# Altium project Driver_Modulation.PrjPcb (part 2 of 2)

## Sheet PD_Receiver_Circuit.SchDoc: Receiver amplifier
size A3; Author: Agni, Peter; SheetNumber: 4; SheetTotal: 9; SPICEModelCacheSWUYWAZA: <root> / <DocumentId>SWUYWAZA</DocumentId> / </root>
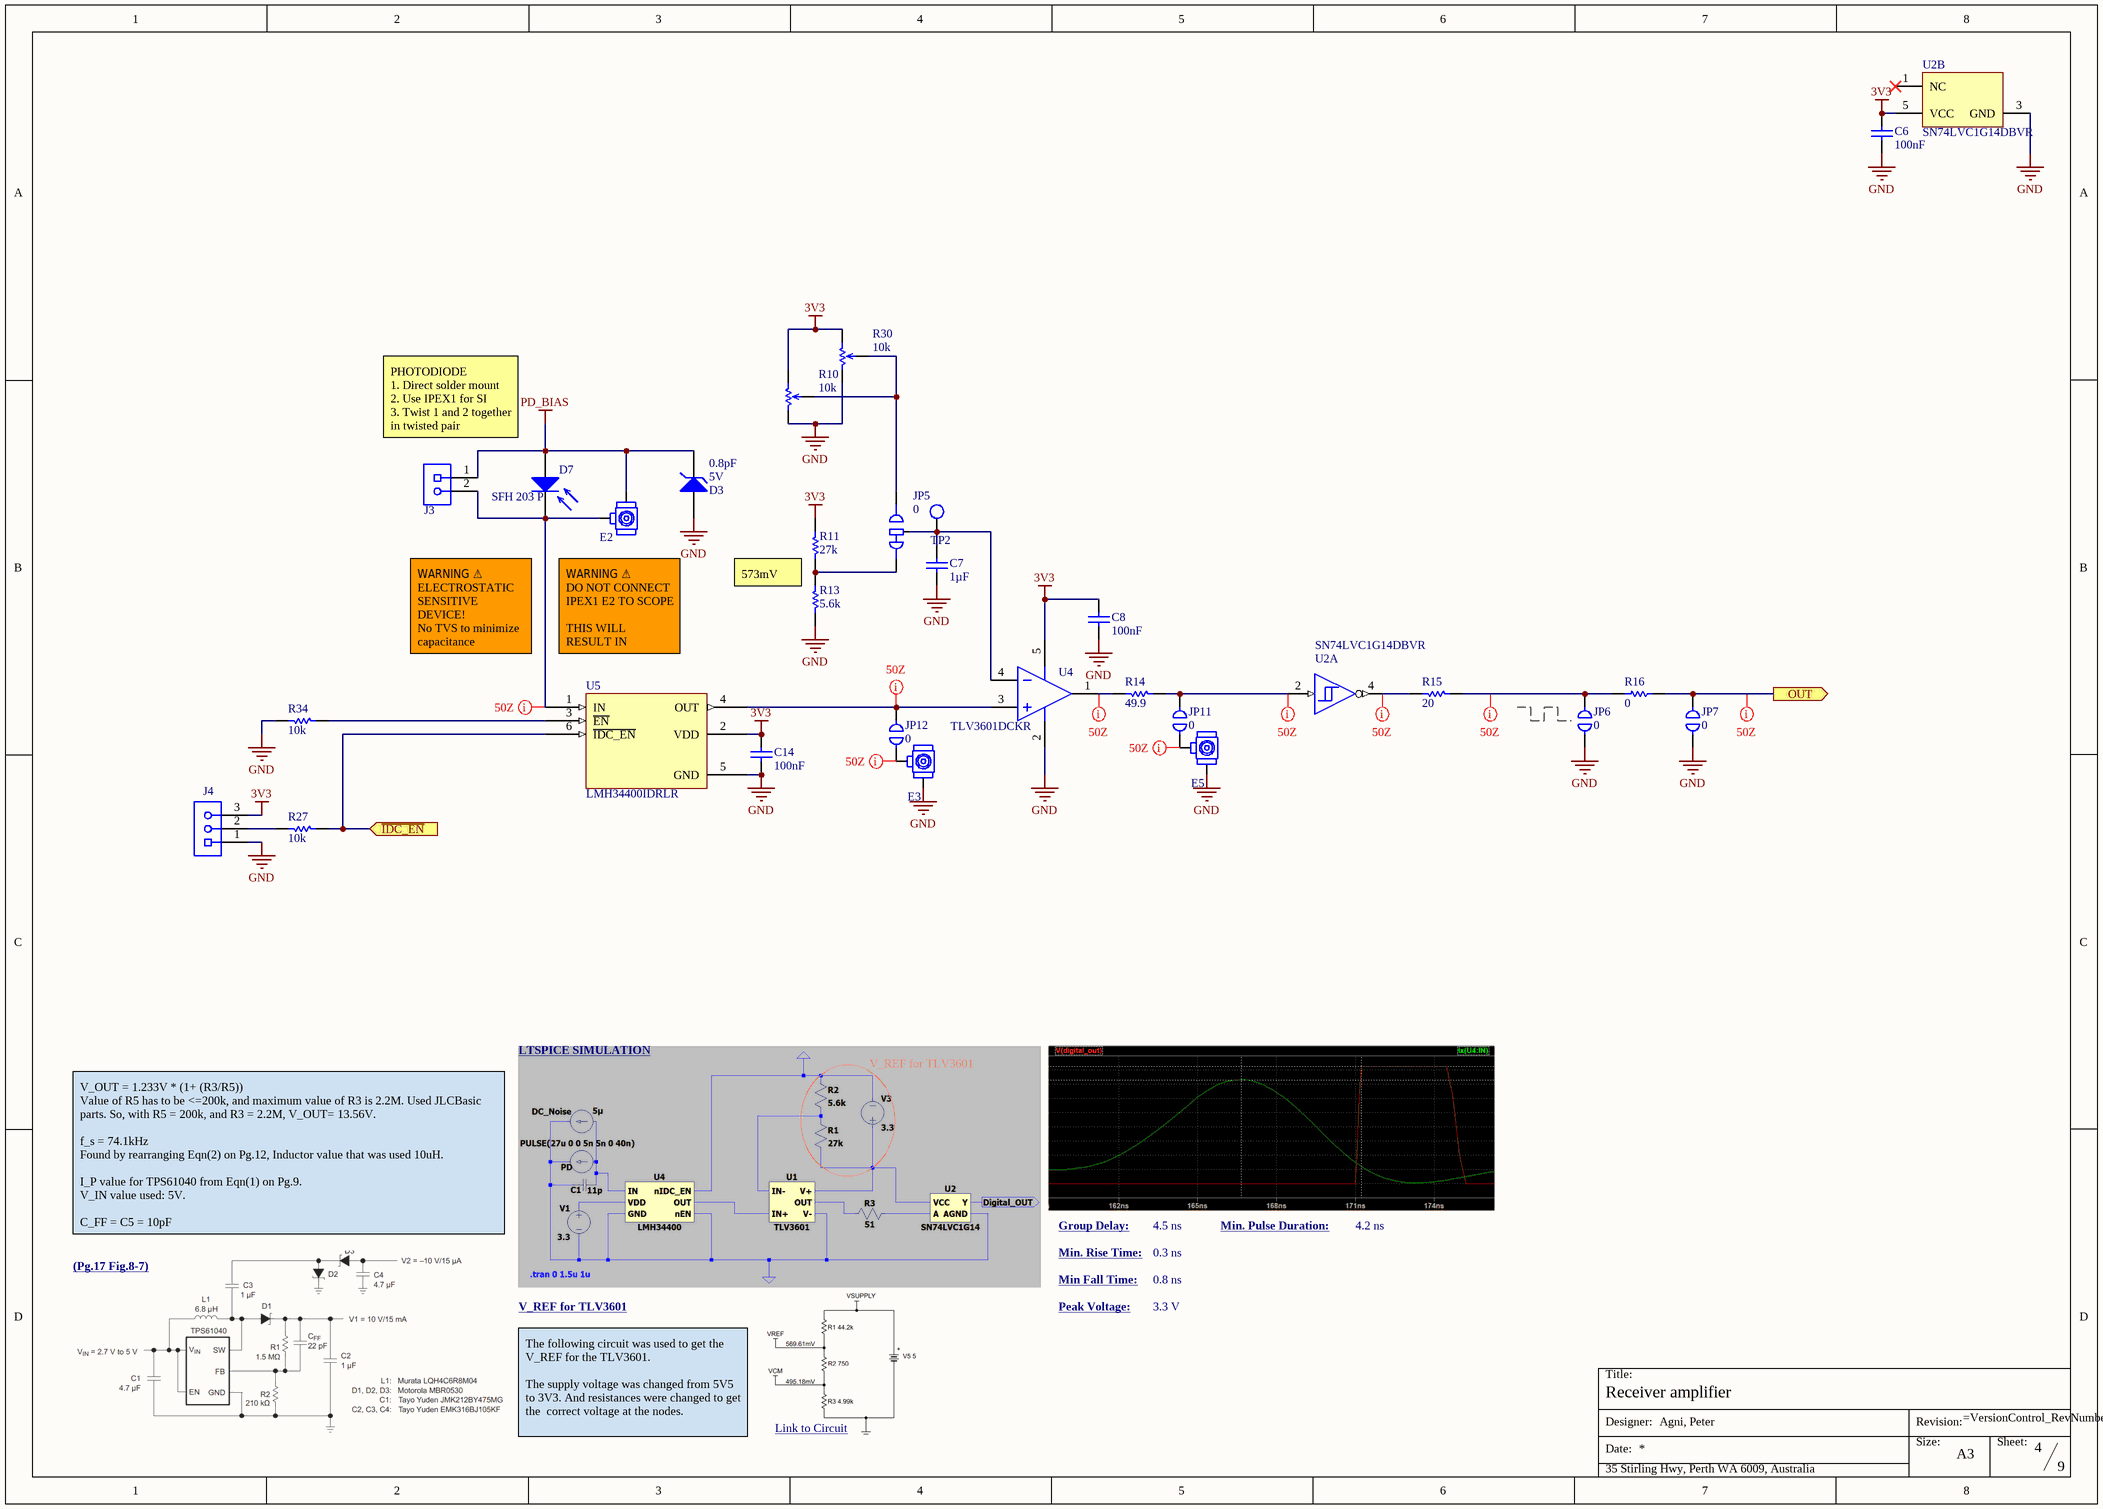
[diagram p5: PD_Receiver_Circuit.SchDoc]

### Parts
C6  value 100nF  [CAPC1005X06N]  (hidden comment: CL05B104KB54PNC)
C7  value 1µF  [CAPC1005X06N]  (hidden comment: CL05A105KA5NQNC)
C8  value 100nF  [CAPC1005X06N]  (hidden comment: CL05B104KB54PNC)
C14  value 100nF  [CAPC1005X06N]  (hidden comment: CL05B104KB54PNC)
D3  value 5V  Capacitance: 0.8pF  [DFN60P100X45-2L]  (hidden comment: H5VU10U)
D7  SFH 203 P  [SFH203P]
E2  U.FL-R-SMT-1(01)  [HRS-U.FL-R-SMT-3_V 4_LAYER_KO]  (value not drawn)
E3  U.FL-R-SMT-1(01)  [HRS-U.FL-R-SMT-3_V 4_LAYER_KO]  (value not drawn)
E5  U.FL-R-SMT-1(01)  [HRS-U.FL-R-SMT-3_V 4_LAYER_KO]  (value not drawn)
J3  B2B-PH-K-S(LF)(SN)  [JST_B2B-PH-K-S(LF)(SN)]  (value not drawn)
J4  10129378-903001BLF  [10129378-903001BLF-Footprint-1]  (value not drawn)
JP5  value 0  [RESC1005X04N TWO STATE]  (hidden comment: JUMPER-0402 TWO STATE)
JP6  value 0  [RESC1005X04N]  (hidden comment: JUMPER-0402)  (no BOM)
JP7  value 0  [RESC1005X04N]  (hidden comment: JUMPER-0402)  (no BOM)
JP11  value 0  [RESC1005X04N]  (hidden comment: JUMPER-0402)  (no BOM)
JP12  value 0  [RESC1005X04N]  (hidden comment: JUMPER-0402)  (no BOM)
R10  value 10k  [BOUR-TC33X-2_V]  (hidden comment: TC33X-2-103E)
R11  value 27k  [RESC1005X04N]  (hidden comment: 0402WGF2702TCE)
R13  value 5.6k  [RESC1005X04N]  (hidden comment: 0402WGF5601TCE)
R14  value 49.9  [RESC1005X04N]  (hidden comment: 0402WGF499JTCE)
R15  value 20  [RESC1608X05N]  (hidden comment: 0603WAF200JT5E)
R16  value 0  [RESC1005X04N]  (hidden comment: 0402WGF0000TCE)
R27  value 10k  [RESC1005X04N]  (hidden comment: CRCW0402-10K0FKED)
R30  value 10k  [POT_RK0971-L-15KC_N-1]  (hidden comment: RK0971114D0B)
R34  value 10k  [RESC1005X04N]  (hidden comment: CRCW0402-10K0FKED)
TP2  Test Point 5001  [FP-5001-MFG]  (value not drawn)
U2  SN74LVC1G14DBVR  [DBV0005A_N]  (parts A,B of 2)
U4  TLV3601DCKR  [DCK0005A_SC-70-5_TI_SOT65P210X110-5N]
U5  LMH34400IDRLR  [SOTFL50P160X60-6N]

### Ports
OUT (out), ~{IDC_EN} (in)

### Nets
3V3: C6.2 C8.2 C14.2 J4.3 R10.3(CW) R11.2 R30.3(CW) U2.5(VCC) U4.5(V+) U5.2(VDD)
GND: C6.1 C7.1 C8.1 C14.1 D3.2(A) E3.2(GND) E5.2(GND) J4.1 JP6.1 JP7.1 R10.1(CCW) R13.1 R30.1(CCW) R34.2 U2.3(GND) U4.2(V-) U5.5(GND)
PD_BIAS: D3.1(K) D7.2(A) E2.2(GND) J3.1
AMBIENT_CANCEL: R27.1 U5.6(~{IDC_EN}) ; port ~{IDC_EN}
OUTPUT: JP7.2 R16.1 ; port OUT
NetC7_2: C7.2 JP5.3(COM) TP2.1 U4.4(IN-)
NetD7_1: D7.1(K) E2.1(SIG) J3.2 U5.1(IN)
NetE3_1: E3.1(SIG) JP12.1
NetE5_1: E5.1(SIG) JP11.1
NetJ4_2: J4.2 R27.2
NetJP5_1: JP5.1 R10.2(W) R30.2(W)
NetJP5_2: JP5.2 R11.1 R13.2
NetJP6_2: JP6.2 R15.2 R16.2
NetJP11_2: JP11.2 R14.2 U2.2(A)
NetJP12_2: JP12.2 U4.3(IN+) U5.4(OUT)
NetR14_1: R14.1 U4.1(OUT)
NetR15_1: R15.1 U2.4(Y)
NetR34_1: R34.1 U5.3(~{EN})

Not connected (* = marked no-connect by the designer): U2 1(NC)*

### Layout directives
net class 50Z: NetD7_1, NetE3_1, NetE5_1, NetJP6_2, NetJP11_2, NetJP12_2, NetR14_1, NetR15_1, OUTPUT

### Notes on the sheet
- PHOTODIODE
  1. Direct solder mount
  2. Use IPEX1 for SI
  3. Twist 1 and 2 together in twisted pair
- 573mV
- WARNING ⚠
  ELECTROSTATIC SENSITIVE DEVICE!
  No TVS to minimize capacitance
  Avoid contact
- WARNING ⚠
  DO NOT CONNECT IPEX1 E2 TO SCOPE
  THIS WILL RESULT IN SHORT-CIRCUIT
- LTSPICE SIMULATION
- V_REF for TLV3601
- V_OUT = 1.233V * (1+ (R3/R5))
  Value of R5 has to be <=200k, and maximum value of R3 is 2.2M. Used JLCBasic parts. So, with R5 = 200k, and R3 = 2.2M, V_OUT= 13.56V.
  f_s = 74.1kHz
  Found by rearranging Eqn(2) on Pg.12, Inductor value that was used 10uH.
  I_P value for TPS61040 from Eqn(1) on Pg.9.
  V_IN value used: 5V.
  C_FF = C5 = 10pF
  C5 = 1/(2*pi*(f_s/20)*R1)
- Group Delay:
- Min. Rise Time:
- 4.5 ns
- 0.3 ns
- Min. Pulse Duration:
- 4.2 ns
- (Pg.17 Fig.8-7) <https://www.ti.com/lit/ds/symlink/tps61041.pdf>
- Min Fall Time:
- Peak Voltage:
- 0.8 ns
- 3.3 V
- The following circuit was used to get the V_REF for the TLV3601.
  The supply voltage was changed from 5V5 to 3V3. And resistances were changed to get the  correct voltage at the nodes.
- Link to Circuit <https://www.ti.com/lit/ab/snoaa83/snoaa83.pdf?ts=1756539067414&ref_url=https%253A%252F%252Fwww.ti.com%252F>
- Title:
- Designer:
- Date:
- Size:
- Revision:
- A3
- Sheet:
- 35 Stirling Hwy, Perth WA 6009, Australia

### Library data of the parts
C6 C8 C14 = CMP-00074-10: Ceramic Capacitor, Multilayer, Ceramic, 50V, 10% +Tol, 10% -Tol, X7R, 15% TC, 0.1uF, Surface Mount, 0402; Dielectric: X7R; RoHS Compliant: Yes; Case Code (Imperial): 0402; Tolerance: 10%; JLC_PN: C307331; Voltage Rating: 50V; Source: JLCPCB(Basic)
C7 = CMP-00190-9: Ceramic Capacitor, Multilayer, Ceramic, 25V, 10% +Tol, 10% -Tol, X5R, 15% TC, 1uF, Surface Mount, 0402; JLC_PN: C52923; RoHS Compliant: Yes; Source: JLCPCB(Basic); Voltage Rating: 25V; Case Code (Imperial): 0402; Dielectric: X5R; Tolerance: 10%
D3 = CMP-00841-4: 5A 55W 16V 9V Unidirectional 5V DFN1006-2L  ESD and Surge Protection (TVS/ESD) ROHS; Breakdown Voltage: 9V; Source: JLCPCB(Basic); JLC_PN: C22395519; Polarity: Unidirectional; RoHS Compliant: Unsure; Package: DFN1006-2L; Peak Pulse Power Dissipation: 55W; Clamping Voltage: 16V
D7 = CMP-111-000002-3: Photodiode PIN Chip 850nm 0.62A/W Sensitivity 2-Pin T-1 3/4; Forward Voltage: 1.3V; Shape: Square; Max Power Dissipation: 150mW; Reverse Voltage: 20V; Fall Time: 5ns; Max Reverse Voltage (DC): 50V; Viewing Angle: 150°; Forward Current: 80mA; Number of Circuits: 1; Dark Current: 5nA; Max Reverse Current: 0A; Max Repetitive Reverse Voltage (Vrrm): 0V; Technology: 0; Peak Wavelength: 850nm; RoHS Compliant: Unsure; Case/Package: Radial; Contact Plating: Tin; Wavelength: 850nm; Rise Time: 5ns; Pins: 2; Height: 4.6mm; Power Dissipation: 150mW; Length: 5.7mm; Source: Distributor; Reverse Voltage (DC): 50V; Width: 5.7mm; Reverse Breakdown Voltage: 50V; Mounting Technology: Through Hole; Max Forward Surge Current (Ifsm): 0A; Diode Type: PIN; Max Operating Temperature: 100°C; Response Time: 5ns; RoHS: Compliant; Min Operating Temperature: -40°C
E2 E3 E5 = CMP-00380-18: Rf Connectors / Coaxial Connectors SMT Ml Rec Au 50 Ohm W/anti Sldr Wicking UFL; Number of Ports: 1; Dielectric Material: Polymer; Impedance: 50; Mating Cycles: 30; Connector Type: Receptacle,Male Pin; Body Plating: Silver; Center Contact Plating: Gold; Max Frequency: 6GHz; Body Material: Bronze; Lead Free: Lead Free; Series: U.FL; JLC PN: C88374; Contact Material: Brass; Fastening Type: SNAP-ON; Min Operating Temperature: -40°C; RoHS Compliant: Yes; Housing Color: Beige; Depth: 3mm; Contact Plating: Gold; Mount: Surface Mount; Length: 3.1mm; Orientation: Vertical; Termination: Solder; Max Operating Temperature: 90°C; Source: UWAA_Stock
J3 = CMP-00690-1: Board Connector, 2 Contact(s), 1 Row(s), Male, Straight, 0.079 inch Pitch, Solder Terminal, Locking, Natural Insulator
J4 = CMP-00188-3: Conn Unshrouded Header HDR 3 POS 2.54mm Solder ST Thru-Hole Poly Bag; RoHS Compliant: Unsure; Source: Aliexpress
JP5 = CMP-009-00003-3: JUMPER-0402 TWO STATE Fixed Resistor, Metal Glaze/thick Film, 0.1W, 0ohm, Surface Mount, 0402; Tolerance: 1%; Power Rating: 100mW; Source: JLCPCB(Basic); JLC_PN: C17168; Case Code (Imperial): 0402; RoHS Compliant: Yes
JP6 JP7 JP11 JP12 = CMP-009-00001-6: 0402 pad placeholder for 0-ohm resistor jumper; Tolerance: 1%; RoHS Compliant: Unsure; Source: Distributor; Case Code (Imperial): 0402
R10 = CMP-00586-3: Res Trimmer 10K Ohm 25% 1/10W 1(Elec)/1(Mech)Turn (3 X 3.8mm) Foot Print SMD Embossed T/R; Temperature Coefficient: 250ppm/°C; Power Rating: 100mW; Case Code (Imperial): 0402; Source: JLCPCB(Basic); Tolerance: 25%; RoHS Compliant: Unsure
R11 = CMP-077-000030-1: Res Thick Film 0402 27K Ohm 1% 0.063W(1/16W) ±100ppm/C Pad SMD T/R; Voltage Rating: 50V; Temperature Coefficient: 100ppm/°C; Power Rating: 62.5mW; Tolerance: 1%; Source: JLCPCB(Basic); Case Code (Imperial): 0402; JLC_PN: C25771; RoHS Compliant: Unsure
R13 = CMP-077-000031-1: 62.5mW Thick Film Resistors 50V ±100ppm/℃ ±1% 5.6kΩ 0402 Chip Resistor - Surface Mount ROHS; Temperature Coefficient: 100ppm/°C; Tolerance: 1%; Case Code (Imperial): 0402; Power Rating: 62.5mW; RoHS Compliant: Unsure; Source: JLCPCB(Basic); JLC_PN: C25908; Voltage Rating: 50V
R14 = CMP-077-000018-1: 62.5mW Thick Film Resistors 50V ±100ppm/℃ ±1% 49.9Ω 0402 Chip Resistor - Surface Mount ROHS; Temperature Coefficient: 200ppm/°C; Power Rating: 62.5mW; Tolerance: 1%; Source: JLCPCB(Basic); RoHS Compliant: Yes; JLC_PN: C25120; Case Code (Imperial): 0402
R15 = CMP-077-000029-1: Res Thick Film 0603 20 Ohm 1% 0.1W(1/10W) ±200ppm/C Pad SMD T/R; Power Rating: 100mW; Voltage Rating: 75V; Temperature Coefficient: 100ppm/℃; Tolerance: 1%; RoHS Compliant: Yes; Source: JLCPCB(Basic); Case Code (Imperial): 0603; JLC_PN: C22950
R16 = CMP-00817-3: Metal Glaze/thick Film, 0.0625W, 0ohm, 0402; Tolerance: 1%; JLC_PN: C17168; RoHS Compliant: Unsure; Case Code (Imperial): 0402; Source: JLCPCB(Basic)
R27 R34 = CMP-00515-7: Res Thick Film 0402 10K Ohm 1% 1/16W ±100ppm/°C Molded SMD Paper T/R; Voltage Rating: 50V; Power Rating: 63mW; RoHS Compliant: Unsure; JLC_PN: C25744; Source: JLCPCB(Basic); Tolerance: 1%; Case Code (Imperial): 0402; Temperature Coefficient: 100ppm/°C
R30 = CMP-077-000032-3: Potentiometer, 0.05W, 10000ohm, 10V, 20% +/-Tol, 1 Turn(s); Power Rating: 50mW; RoHS Compliant: Unsure; Case Code (Imperial): N/A; Voltage Rating: 10V; Tolerance: 20%; Source: Aliexpress
TP2 = CMP-001-0013-1: MS27478 - Connectors Receptacle Electrical Solder Mounting Solder Type Hermetic Seal 38999 Series II Test Point; Voltage Rating: 0V; Current Rating: 0A; Number of Contacts: 1; Contact Material: Silver; RoHS Compliant: Unsure; Housing Color: Black; Height: 4.72mm; Length: 7.62mm; Orientation: Straight; Termination: Through Hole; Gender: -; Mounting Technology: Through Hole; Number of Rows: 1; Source: UWAA_Stock; Contact Plating: Tin
U2 = CMP-071-000015-2: Single 1.65-V to 5.5-V inverter with Schmitt-Trigger inputs 5-SOT-23 -40 to 125; Manufacturer Lifecycle Status: ACTIVE; Logic Function: Inverting; Low Level Output Current: 32mA; Quiescent Current: 10µA; High Level Output Current: -32mA; Number of Gates: 1; Turn-On Delay Time: 11ns; Max Junction Temperature (Tj): 150°C; Max Supply Voltage: 5.5V; Min Supply Voltage: 1.65V; Mounting Technology: Surface Mount; Max Operating Temperature: 125°C; Lifecycle Status: Production; Lead Free: Lead Free; Length: 2.9mm; Max Output current: 32mA; Termination: SMD/SMT; Number of Elements: 1; Number of Circuits: 1; Number of Channels: 1; Case/Package: SOT-23; Schedule B: 8542390000, 8542390000; JLC_PN: C7835; Weight: 15.790684mg; Thickness: 1.2mm; Output Current: 32mA; Number of Outputs: 1; RoHS: Compliant; Radiation Hardening: No; Packaging: Cut Tape; Contact Plating: Tin; Source: Distributor; Number of Bits: 1; REACH SVHC: No; Propagation Delay: 11ns; Width: 1.6mm; Number of Inputs: 1; Pins: 5; Min Operating Temperature: -40°C; Height: 1.45mm
U4 = CMP-00909-3: 2.5-ns high-speed rail-to-rail comparator with push-pull outputs 5-SC70 -40 to 125; Manufacturer Lifecycle Status: ACTIVE; Number of Channels: 1; RoHS: Compliant; Width: 1.25mm; Lifecycle Status: Production; JLC_PN: C2974371; Length: 2mm; Source: JLCPCB(Extended,Economic_PCBA); Pins: 5; RoHS Compliant: Unsure; Height: 1.1mm; Thickness: 900µm
U5 = CMP-00906-2: "240-MHZ, Single-ended, Transimpe" Transimpedance Amplifier IC SOT-563; Manufacturer Lifecycle Status: ACTIVE; Lifecycle Status: Production; RoHS: Compliant; Length: 1.6mm; JLC_PN: C19723951; Width: 1.2mm; Height: 600µm; Thickness: 550µm; Pins: 6; Source: JLCPCB(Extended,Economic_PCBA)

## Sheet Alignment_driver.SchDoc: Alignment Laser
size A4; Author: Won Chen; SheetNumber: 7; SheetTotal: 9; SPICEModelCacheKWXMVFZK: <root> / <DocumentId>KWXMVFZK</DocumentId> / <CacheFrame Number="0"> / <Model Name="si2302cds" Kind="CKT"> / <Text>*August 11, 2008 / *Doc. ID: 68508, S-81826, Rev. A / *File Name: Si2302CDS_PS.txt and Si2302CDS_PS.lib / *This document is intended as a SPICE modeling guideline and does not / *constitute a commercial product data sheet.  Designers should refer to the / *appropriate data sheet of the same number for guaranteed specification / *limits. / .SUBCKT Si2302CDS D G S / M1  3  GX S S NMOS W=273327u L=0.250u / M2  S  GX S D PMOS W=273327u L=0.235u / RG  G  GX     4 / R1  D  3      RTEMP 18E-3 / CGS GX S      201E-12 / DBD S  D      DBD / *********************************************************** / .MODEL  NMOS       NMOS ( LEVEL  = 3        TOX    = 1.7E-8 / + RS     = 18E-3          RD     = 0        NSUB   = 2.45E17 / + KP     = 2.8E-5         UO     = 650 / + VMAX   = 0              XJ     = 5E-7     KAPPA  = 3E-2 / + ETA    = 1E-4           TPG    = 1 / + IS     = 0              LD     = 0 / + CGSO   = 0              CGDO   = 0        CGBO   = 0 / + NFS    = 0.8E12         DELTA  = 0.1) / ************************************************************ / .MODEL  PMOS       PMOS ( LEVEL  = 3        TOX    = 1.7E-8 / +NSUB    = 2E17           IS     = 0        TPG    = -1) / ************************************************************ / .MODEL DBD D (CJO=60E-12 VJ=0.38 M=0.26 / +FC=0.5 TT=4.71E-8 T_MEASURED=25 BV=21 / +RS=4.856e-02 N=1.214 IS=5.289e-09 IKF=1000 / +EG=5.600e-01 XTI=8.258 TRS1=2.944e-12) / ************************************************************ / .MODEL RTEMP RES (TC1=8E-3 TC2=5.5E-6) / ************************************************************ / .ENDS</Text> / </Model> / <Model Name="ao3401" Kind="MDL"> / <Text>.model AO3401 VDMOS Rg=7.8 Rd=0m Rs=0.2m Vto=-1.2 Kp=17 Cgdmax=400p Cgdmin=80p Cgs=645p Cjo=147p Is=10p Rb=0.2m Pchan mfg=Alpha_&amp;_Omega ksubthres=.1</Text> / </Model> / </CacheFrame> / </root>
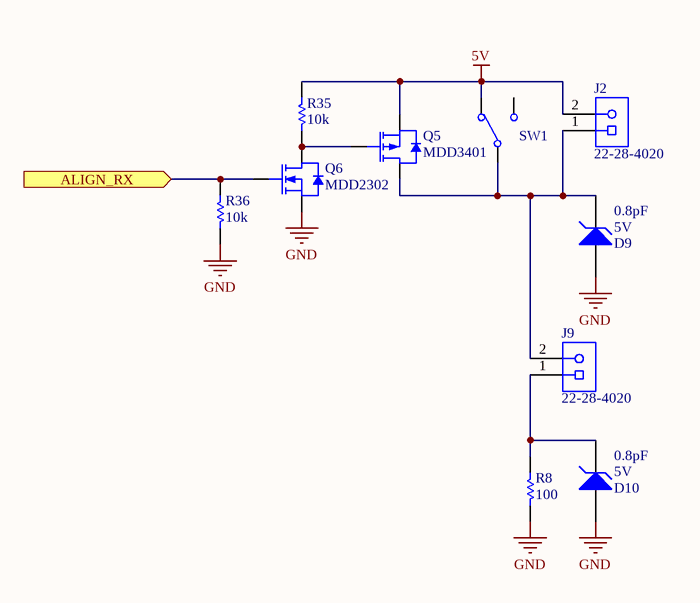
[diagram p6: Alignment_driver.SchDoc]

### Parts
D9  value 5V  Capacitance: 0.8pF  [DFN60P100X45-2L]  (hidden comment: H5VU10U)
D10  value 5V  Capacitance: 0.8pF  [DFN60P100X45-2L]  (hidden comment: H5VU10U)
J2  22-28-4020  [22-28-4020-Footprint-1]
J9  22-28-4020  [22-28-4020-Footprint-1]
Q5  MDD3401  [SOT95P252X140-3N]
Q6  MDD2302  [SOT95P252X140-3N]
R8  value 100  [RESC1005X04N]  (hidden comment: 0402WGF1000TCE)
R35  value 10k  [RESC1005X04N]  (hidden comment: CRCW0402-10K0FKED)
R36  value 10k  [RESC1005X04N]  (hidden comment: CRCW0402-10K0FKED)
SW1  PCM12SMTR  [PCM12SMTR-Footprint-1]  (value not drawn)

### Ports
ALIGN_RX (in)

### Nets
5V: J2.2 Q5.2(S) R35.2 SW1.3
GND: D9.2(A) D10.2(A) Q6.2(S) R8.1 R36.1
ALIGN_RX: Q6.1(G) R36.2 ; port ALIGN_RX
NetD9_1: D9.1(K) J2.1 J9.2 Q5.3(D) SW1.2
NetD10_1: D10.1(K) J9.1 R8.2
NetQ5_1: Q5.1(G) Q6.3(D) R35.1

Not connected (* = marked no-connect by the designer): SW1 1

### Notes on the sheet
- Title:
- Designer:
- Date:
- Size:
- Revision:
- A4
- Sheet:
- 35 Stirling Hwy, Perth WA 6009, Australia

### Library data of the parts
D9 D10 = CMP-00841-4: as D3 on sheet PD_Receiver_Circuit; Breakdown Voltage: 9V; Source: JLCPCB(Basic); JLC_PN: C22395519; Polarity: Unidirectional; RoHS Compliant: Unsure; Package: DFN1006-2L; Peak Pulse Power Dissipation: 55W; Clamping Voltage: 16V
J2 J9 = CMP-00157-5: KK 254 Breakaway Header, Vertical, 2 Circuits, Tin (Sn) Plating, Mating Pin Length 6.09mm 2 POS; Connector Type: Male Pin; Current Rating: 4A; Pitch: 2.54mm; Contact Resistance: 20m; Gender: Male; Voltage Rating: 250V; Number of Contacts: 2; Mounting Technology: Through Hole; Depth: 2.49mm; Termination: Solder; Max Operating Temperature: 75°C; Number of Rows: 1; Contact Plating: Tin; Contact Material: Brass,Bronze; Min Operating Temperature: 0°C; Housing Color: Black; Housing Material: Nylon; Orientation: Straight; RoHS Compliant: Unsure; Source: Aliexpress
Q5 = CMP-00682-5: 30V 4.2A 45mΩ@10V P Channel SOT-23 MOSFETs ROHS; Input Capacitance: 655pF; Rds On Max: 57m; Drain to Source Voltage (Vdss): -30V; Max Power Dissipation: 1.2W; Gate to Source Voltage (Vgs): 12V; Threshold Voltage: -1.2V; Continuous Drain Current (ID): 4.2A; Case/Package: SOT-23; JLC_PN: C427383; Type: P Channel; RoHS Compliant: Unsure; Source: JLCPCB(Extended,Economic_PCBA)
Q6 = CMP-00703-4: 4A 25mΩ@4.5V null SOT-23 MOSFETs ROHS N CHANNEL; Max Power Dissipation: 1.25W; Input Capacitance: 340pF; Gate to Source Voltage (Vgs): 12V; Drain to Source Voltage (Vdss): 20V; Threshold Voltage: 1.2V; Rds On Max: 28m; RoHS Compliant: Unsure; Source: JLCPCB(Basic); Type: N channel; JLC_PN: C427390; Continuous Drain Current (ID): 4A; Case/Package: SOT-23
R8 = CMP-00655-3: Fixed Resistor, Metal Glaze/thick Film, 0.0625W, 100ohm, 50V, 1% +/-Tol, 100ppm/Cel, Surface Mount, 0402; RoHS Compliant: Yes; JLC_PN: C25076; Tolerance: 1%; Source: JLCPCB(Basic); Case Code (Imperial): 0402
R35 R36 = CMP-00515-7: Res Thick Film 0402 10K Ohm 1% 1/16W ±100ppm/°C Molded SMD Paper T/R; Power Rating: 63mW; Voltage Rating: 50V; Source: JLCPCB(Basic); JLC_PN: C25744; Tolerance: 1%; Temperature Coefficient: 100ppm/°C; Case Code (Imperial): 0402; RoHS Compliant: Unsure
SW1 = CMP-00120-3: C & K COMPONENTS - PCM12SMTR - SWITCH, SPDT, 0.3A, 6VDC, SMD; Voltage Rating (DC): 6V; Max Current Rating: 300mA; Actuator Type: Standard; Switch Function: On-On; Switch Travel: 1.5mm; Insulation Resistance: 100mR; Mechanical Life: 10000Cycles; Contact Resistance: 70mR; Actuator Material: Nylon,Polyamide; Length: 7.7mm; Contact Plating: Silver; Current Rating: 300mA; Min Operating Temperature: -20°C; Contact Current Rating: 300mA; Max Voltage Rating (DC): 6V; Max Operating Temperature: 85°C; Termination: Gull Wing; Package Quantity: 1; Width: 6.7mm; Orientation: Right Angle; Voltage Rating (AC): 6V; Lead Free: Lead Free; Mount: Surface Mount; Actuator Length: 1.5mm; Packaging: Tape and Reel; Contact Material: Copper Alloy,Copper,Silver; Throw Configuration: SPDT; REACH SVHC: No SVHC; Depth: 5mm; Source: Distributor

## Sheet buzzer.SchDoc: Buzzer
size A4; Author: Peter Tanner; SheetNumber: 8; SheetTotal: 9
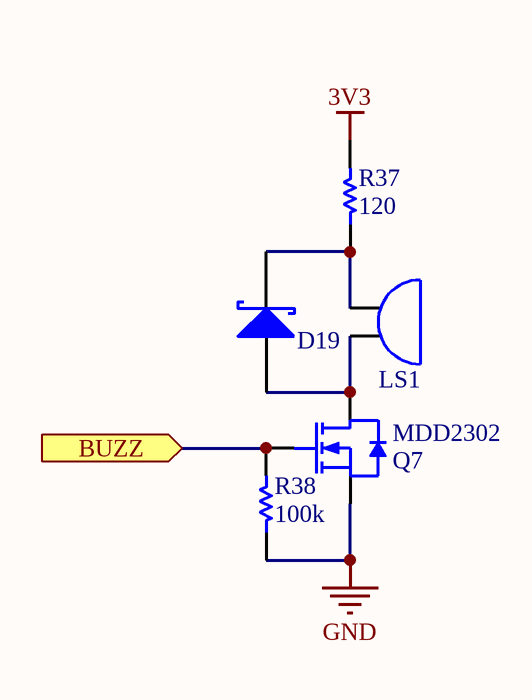
[diagram p7: buzzer.SchDoc]

### Parts
D19  RB521S30T1G  [SODFL160X70-2N]  (value not drawn)
LS1  TMB12A03  [TMB12A03 -Footprint-1]  (value not drawn)
Q7  MDD2302  [SOT95P252X140-3N]
R37  value 120  [RESC1005X04N]  (hidden comment: 0402WGF1200TCE)
R38  value 100k  [RESC1005X04N]  (hidden comment: CRCW0402100KFKEDC)

### Ports
BUZZ (in)

### Nets
3V3: R37.2
GND: Q7.2(S) R38.1
ALIGN_TX: Q7.1(G) R38.2 ; port BUZZ
NetD19_1: D19.1(K) LS1.1 R37.1
NetD19_2: D19.2(A) LS1.2 Q7.3(D)

### Notes on the sheet
- Title:
- Designer:
- Date:
- Size:
- Revision:
- A4
- Sheet:
- 35 Stirling Hwy, Perth WA 6009, Australia

### Library data of the parts
D19 = CMP-00227-5: SCHOTTKY BARRIER DIODE Rectifier Diode, Schottky, 1 Phase, 1 Element, 0.2A, 30V V(RRM), Silicon RB521S-30; Max Reverse Current: 30µA; Power Dissipation: 200mW; Max Forward Surge Current (Ifsm): 1A; Forward Current: 200mA; Forward Voltage: 500mV; Case/Package: SOD-523-2; JLC_PN: C7502702; Technology: SCHOTTKY; Source: JLCPCB(Basic); RoHS Compliant: Yes; Max Repetitive Reverse Voltage (Vrrm): 30V
LS1 = CMP-00694-4: Active (driven circuit included) 85dB@3V,10cm Magnetic 2300Hz Plugin,D=12mm Buzzers ROHS; Operating Voltage: 1.5V~4V; Frequency: 2300Hz; Height: 9.8mm; Diameter (φD): 12mm; Technology Type: Magnetic; Sound Pressure Level (SPL): 85dB@3V,10cm; Oscillator Circuit: Active (driven circuit included); Source: Aliexpress
Q7 = CMP-00703-4: 4A 25mΩ@4.5V null SOT-23 MOSFETs ROHS N CHANNEL; Drain to Source Voltage (Vdss): 20V; Gate to Source Voltage (Vgs): 12V; Input Capacitance: 340pF; Max Power Dissipation: 1.25W; Rds On Max: 28m; Threshold Voltage: 1.2V; JLC_PN: C427390; Type: N channel; Continuous Drain Current (ID): 4A; Case/Package: SOT-23; RoHS Compliant: Unsure; Source: JLCPCB(Basic)
R37 = CMP-00689-3: Fixed Resistor, Metal Glaze/thick Film, 0.0625W, 120ohm, 50V, 1% +/-Tol, 100ppm/Cel, Surface Mount, 0402; Temperature Coefficient: 100ppm/°C; Power Rating: 62.5mW; JLC_PN: C25079; RoHS Compliant: Yes; Tolerance: 1%; Case Code (Imperial): 0402; Source: JLCPCB(Basic)
R38 = CMP-00094-5: RES 100K OHM 1% 1/16W 0402; Power Rating: 62.5mW; Temperature Coefficient: 100ppm/°C; JLC_PN: C25741; Tolerance: 1%; Case Code (Imperial): 0402; RoHS Compliant: Unsure; Source: JLCPCB(Basic)

## Sheet external_LD_mounting.SchDoc: External Laser Mounting PCB
size A4; Author: Peter Tanner; SheetNumber: 9; SheetTotal: 9
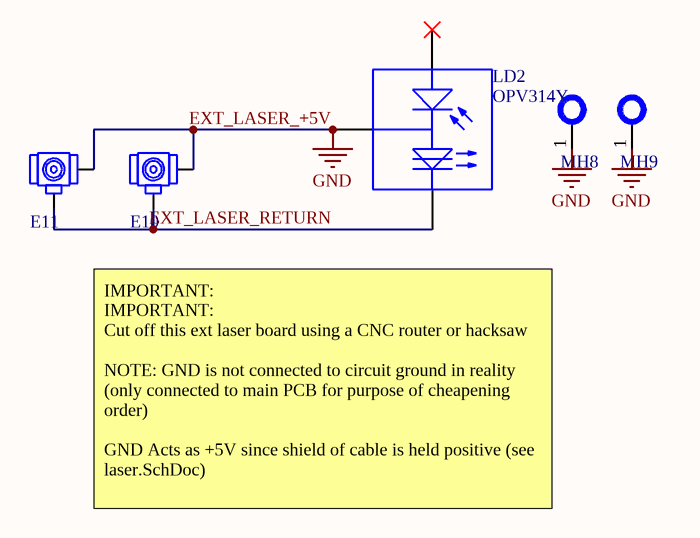
[diagram p8: external_LD_mounting.SchDoc]

### Parts
E10  U.FL-R-SMT-1(01)  [HRS-U.FL-R-SMT-3_V 4_LAYER_KO]  (value not drawn)
E11  U.FL-R-SMT-1(01)  [HRS-U.FL-R-SMT-3_V 4_LAYER_KO]  (value not drawn)
LD2  OPV314Y  [LASER_TO-18]
MH8  Mounting hole M3  [Mounting hole M3-Footprint-1]  (value not drawn)  (no BOM)
MH9  Mounting hole M3  [Mounting hole M3-Footprint-1]  (value not drawn)  (no BOM)

### Nets
GND: E10.2(GND) E11.2(GND) LD2.2(COM) MH8.1 MH9.1  [also labelled EXT_LASER_+5V]
EXT_LASER_RETURN: E10.1(SIG) E11.1(SIG) LD2.1(LD_K)

Not connected (* = marked no-connect by the designer): LD2 3(PD_A)*

### Notes on the sheet
- IMPORTANT:
  IMPORTANT:
  Cut off this ext laser board using a CNC router or hacksaw
  NOTE: GND is not connected to circuit ground in reality (only connected to main PCB for purpose of cheapening order)
  GND Acts as +5V since shield of cable is held positive (see laser.SchDoc)
- Title:
- Designer:
- Date:
- Size:
- Revision:
- A4
- Sheet:
- 35 Stirling Hwy, Perth WA 6009, Australia

### Library data of the parts
E10 E11 = CMP-00380-18: as E2 on sheet PD_Receiver_Circuit; Lead Free: Lead Free; Series: U.FL; JLC PN: C88374; Contact Material: Brass; Fastening Type: SNAP-ON; Min Operating Temperature: -40°C; RoHS Compliant: Yes; Housing Color: Beige; Depth: 3mm; Contact Plating: Gold; Mount: Surface Mount; Length: 3.1mm; Orientation: Vertical; Termination: Solder; Max Operating Temperature: 90°C; Source: UWAA_Stock
LD2 = CMP-00026-00000-5: VCSEL Emitter, 840nm Min, 860nm Max, 2500Mbps, TO-46, Through Hole Mount; Max Supply Voltage: 2.2V; Supply Current: 15mA; Body Height: 3.66mm; Operating Wavelength-Nom: 850nm; Threshold Current-Min: 3mA; Body Length or Diameter: 4.67mm; Transmission Type: Digital; Fall Time-Max: 0.1ns; Min Supply Voltage: 1.6V; Spectral Width: 0.85nm; Built-in Feature: MONITOR PHOTODIODE; Number of Channels: 1; Min Operating Temperature: 0°C; Max Operating Temperature: 70°C; Data Rate: 2500Mbps; Package Style: TO-46Meter; RoHS Compliant: Yes; Reach SVHC Compliant: Yes; Operating Wavelength-Max: 860nm; Mounting Technology: Through Hole; Operating Wavelength-Min: 840nm; Fiber Optic Device Type: VCSEL EMITTER; Rise Time: 0.1ns; Source: Distributor
MH8 MH9 = CMP-00600-10: Close fit Di3.2 mm Alt: M3 nut flange

## Nets that join several sheets
2V7: bias (C1.2 IC1.5 IC1.6 J6.2), Driver_Modulation (C2.2 IC2.5 IC2.6 J1.2), Power_Regulation (C13.2 R20.2 U7.5)
3V3: ROOT (J14.1), laser (JP10.2), Driver_Modulation (C5.2 U1.8), Power_Regulation (5 pins), PD_Receiver_Circuit (10 pins), buzzer (R37.2)
5V: ROOT (J10.3 J10.6), laser (10 pins), Power_Regulation (11 pins), Alignment_driver (J2.2 Q5.2 R35.2 SW1.3)
GND: ROOT (12 pins), laser (8 pins), bias (8 pins), Driver_Modulation (18 pins), Power_Regulation (18 pins), PD_Receiver_Circuit (17 pins), Alignment_driver (5 pins), buzzer (Q7.2 R38.1), external_LD_mounting (5 pins)
PD_BIAS: Power_Regulation (C22.2 R32.1), PD_Receiver_Circuit (D3.1 D7.2 E2.2 J3.1)
ALIGN_RX: ROOT (J11.3), Alignment_driver (Q6.1 R36.2)
ALIGN_TX: ROOT (J11.4), buzzer (Q7.1 R38.2)
AMBIENT_CANCEL: ROOT (J12.7), PD_Receiver_Circuit (R27.1 U5.6)
INPUT: ROOT (E7.1), Driver_Modulation (JP3.2 R7.2)
LD_K: laser (5 pins), bias (Q1.1), Driver_Modulation (Q2.1)
NetJ14_2: ROOT (J14.2), laser (Q4.1 R28.2)
OUTPUT: ROOT (E6.1), PD_Receiver_Circuit (JP7.2 R16.1)
UNSHORT: ROOT (J12.8), laser (JP10.1)

## Assembly variants
PRODUCTION_JLCPCB: not fitted D7 E1 E2 E3 E4 E5 E6 E7 E8 E9 E10 E11 J1 J2 J3 J4 J5 J6 J8 J9 J10 J11 J12 J13 J14 K1 L1 LD1 LD2 LS1 R3 R4 R10 R29 R30 R31 SW1 TP1 TP2 TP3 TP5 TP6 U1 U2 U7
PRODUCTION: not fitted E1 E2 E3 E4 E5 E8 J3 J8 K1 LD1 R3 R4 R10 TP1 TP2 TP3 TP5 TP6
PRODUCTION_MANUAL: not fitted C1 C2 C3 C4 C5 C6 C7 C8 C9 C10 C11 C12 C13 C14 C15 C16 C17 C18 C19 C20 C21 C22 D1 D2 D3 D4 D5 D6 D8 D9 D10 D11 D12 D13 D14 D15 D16 D17 D18 D19 E1 E2 E3 E4 E5 E8 IC1 IC2 J3 J8 JP2 JP3 JP4 JP5 JP6 JP7 JP8 JP9 JP10 JP11 JP12 K1 LD1 Q1 Q2 Q3 Q4 Q5 Q6 Q7 R1 R2 R3 R4 R5 R6 R7 R8 R9 R10 R11 R12 R13 R14 R15 R16 R17 R18 R19 R20 R21 R22 R23 R24 R25 R26 R27 R28 R32 R33 R34 R35 R36 R37 R38 TP1 TP2 TP3 TP5 TP6 U3 U4 U5 U6